# Altium schematic sheet STM8_LQFP64_DEVELOPMENT_BOARD.SchDoc
size A; SheetNumber: 1; SheetTotal: 1
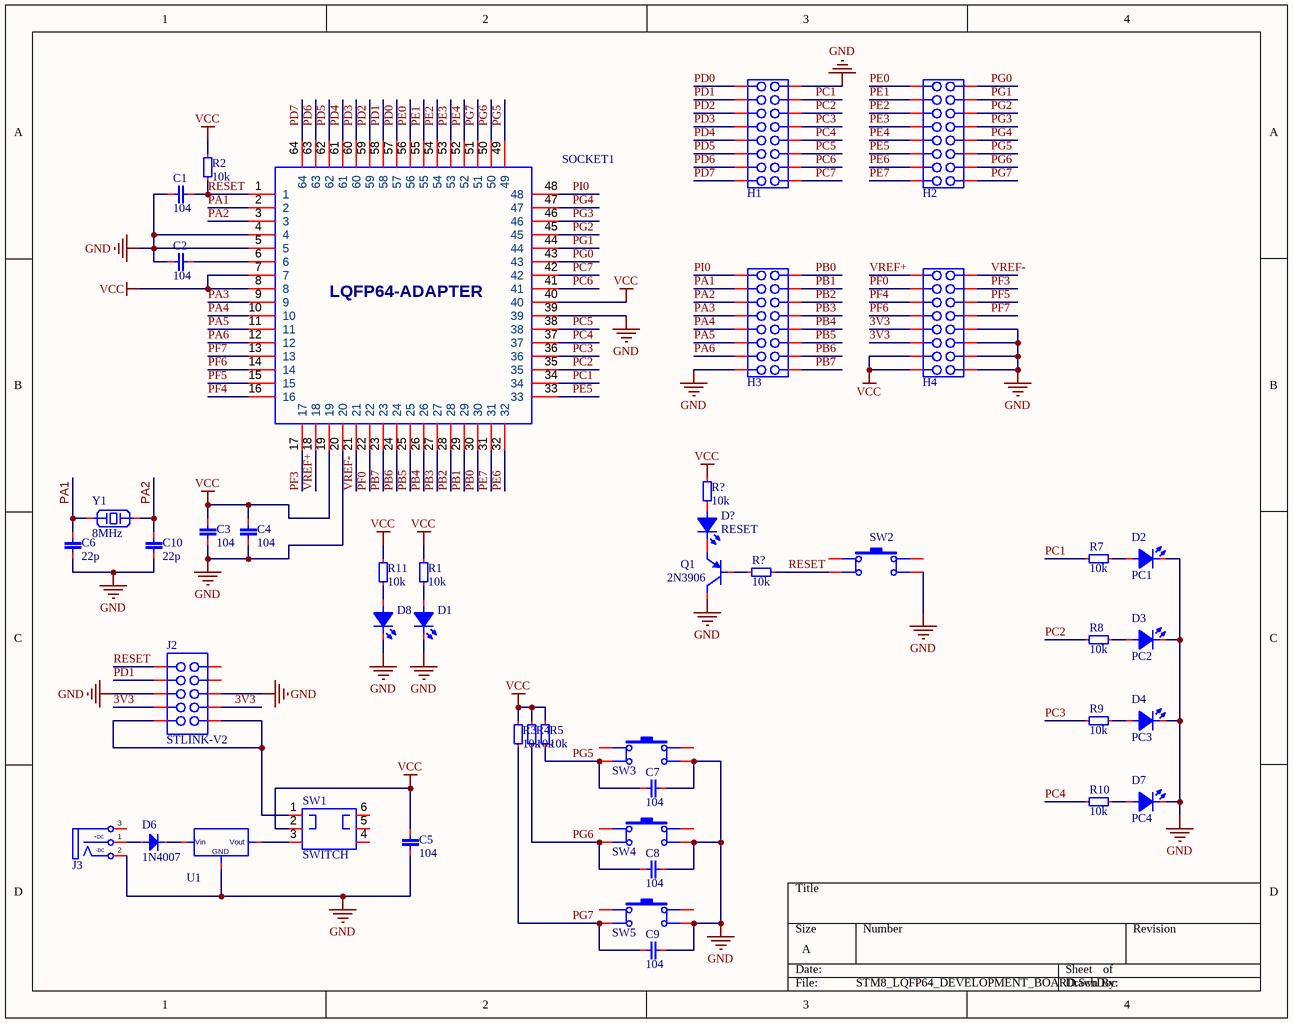
[diagram p0: STM8_LQFP64_DEVELOPMENT_BOARD.SchDoc]

## Parts
(Parts that share a designator on the sheet are numbered #1, #2 ... from top to bottom, then left to right.)
C1  104  [C0805]
C2  104  [C0805]
C3  104  [C1812]
C4  104  [C0805]
C5  104  [C1812]
C6  22p  [C0805]
C7  104  [C0805]
C8  104  [C0805]
C9  104  [C0805]
C10  22p  [C0805]
D1  LED0805  [L0805RED]  (value not drawn)
D2  PC1  [L0805RED]
D3  PC2  [L0805RED]
D4  PC3  [L0805RED]
D6  1N4007  [DO-214AC]
D7  PC4  [L0805RED]
D8  LED0805  [L0805RED]  (value not drawn)
D?  RESET  [L0805RED]
H1  HEADER-MALE-DOUBLE  [HEADER-MALE-DOUBLE-16PINS-2.54MM]  (value not drawn)
H2  HEADER-MALE-DOUBLE  [HEADER-MALE-DOUBLE-16PINS-2.54MM]  (value not drawn)
H3  HEADER-MALE-DOUBLE  [HEADER-MALE-DOUBLE-16PINS-2.54MM]  (value not drawn)
H4  HEADER-MALE-DOUBLE  [HEADER-MALE-DOUBLE-16PINS-2.54MM]  (value not drawn)
J2  STLINK-V2  [IDC_CONNECTOR_10x2.54]
J3  Connector  [DC_K375A_Power]  (value not drawn)
Q1  2N3906  [SOT23-3]
R1  10k  [R0805]
R2  10k  [R0805]
R3  10k  [R0805]
R4  10k  [R0805]
R5  10k  [R0805]
R7  10k  [R0805]
R8  10k  [R0805]
R9  10k  [R0805]
R10  10k  [R0805]
R11  10k  [R0805]
R?#1  10k  [R0805]
R?#2  10k  [R0805]
SOCKET1  STM8 MICROCONTROLLER  [SOCKET-ADAPTER-OTQ-64-05-03]  (value not drawn)
SW1  SWITCH  [SWITCH 5.8x5.8 6 PINS]
SW2  RESET  [BUTTON_HOLE_4.3mm]  (value not drawn)
SW3  PG5  [BUTTON_HOLE_4.3mm]  (value not drawn)
SW4  PG6  [BUTTON_HOLE_4.3mm]  (value not drawn)
SW5  PG7  [BUTTON_HOLE_4.3mm]  (value not drawn)
U1  AMS1117  [SOT223-3]  (value not drawn)
Y1  8MHz  [HC-49_THROUGH]

## Nets
GND: C1.1 C2.1 C3.1 C4.1 C5.1 C6.1 C7.2 C8.2 C9.2 C10.1 D1.2(K) D2.2(K) D3.2(K) D4.2(K) D7.2(K) D8.2(K) H1.2 H3.15 H4.10 H4.12 H4.14 H4.16 J2.5 J2.6 J3.2(DC-) Q1.3(C) SOCKET1.4 SOCKET1.5 SOCKET1.20 SOCKET1.39 SW2.4 SW3.4 SW4.4 SW5.4 U1.1
VCC: C3.2 C4.2 C5.2 H4.13 H4.15 R1.2 R2.1 R3.1 R4.1 R5.1 R11.2 R?#1.2 SOCKET1.7 SOCKET1.8 SOCKET1.19 SOCKET1.40 SW1.2
3V3: H4.9 H4.11 J2.7 J2.8
PA1: C6.2 H3.3 SOCKET1.2 Y1.1
PA2: C10.2 H3.5 SOCKET1.3 Y1.2
PA3: H3.7 SOCKET1.9
PA4: H3.9 SOCKET1.10
PA5: H3.11 SOCKET1.11
PA6: H3.13 SOCKET1.12
PB0: H3.2 SOCKET1.30
PB1: H3.4 SOCKET1.29
PB2: H3.6 SOCKET1.28
PB3: H3.8 SOCKET1.27
PB4: H3.10 SOCKET1.26
PB5: H3.12 SOCKET1.25
PB6: H3.14 SOCKET1.24
PB7: H3.16 SOCKET1.23
PC1: H1.4 R7.2 SOCKET1.34
PC2: H1.6 R8.2 SOCKET1.35
PC3: H1.8 R9.2 SOCKET1.36
PC4: H1.10 R10.2 SOCKET1.37
PC5: H1.12 SOCKET1.38
PC6: H1.14 SOCKET1.41
PC7: H1.16 SOCKET1.42
PD0: H1.1 SOCKET1.57
PD1: H1.3 J2.3 SOCKET1.58
PD2: H1.5 SOCKET1.59
PD3: H1.7 SOCKET1.60
PD4: H1.9 SOCKET1.61
PD5: H1.11 SOCKET1.62
PD6: H1.13 SOCKET1.63
PD7: H1.15 SOCKET1.64
PE0: H2.1 SOCKET1.56
PE1: H2.3 SOCKET1.55
PE2: H2.5 SOCKET1.54
PE3: H2.7 SOCKET1.53
PE4: H2.9 SOCKET1.52
PE5: H2.11 SOCKET1.33
PE6: H2.13 SOCKET1.32
PE7: H2.15 SOCKET1.31
PF0: H4.3 SOCKET1.22
PF3: H4.4 SOCKET1.17
PF4: H4.5 SOCKET1.16
PF5: H4.6 SOCKET1.15
PF6: H4.7 SOCKET1.14
PF7: H4.8 SOCKET1.13
PG0: H2.2 SOCKET1.43
PG1: H2.4 SOCKET1.44
PG2: H2.6 SOCKET1.45
PG3: H2.8 SOCKET1.46
PG4: H2.10 SOCKET1.47
PG5: C7.1 H2.12 R5.2 SOCKET1.49 SW3.2
PG6: C8.1 H2.14 R4.2 SOCKET1.50 SW4.2
PG7: C9.1 H2.16 R3.2 SOCKET1.51 SW5.2
PI0: H3.1 SOCKET1.48
RESET: C1.2 J2.1 R2.2 R?#2.1 SOCKET1.1 SW2.2
VREF+: H4.1 SOCKET1.18
VREF-: H4.2 SOCKET1.21
NetC2_2: C2.2 SOCKET1.6
NetD1_1: D1.1(A) R1.1
NetD2_1: D2.1(A) R7.1
NetD3_1: D3.1(A) R8.1
NetD4_1: D4.1(A) R9.1
NetD6_1: D6.1 J3.1(DS+)
NetD6_2: D6.2 U1.3
NetD7_1: D7.1(A) R10.1
NetD8_1: D8.1(A) R11.1
NetD?_1: D?.1(A) R?#1.1
NetD?_2: D?.2(K) Q1.2(E)
NetJ2_9: J2.9 J2.10 SW1.1
NetQ1_1: Q1.1(B) R?#2.2
NetSW1_3: SW1.3 U1.2

Not connected (* = marked no-connect by the designer): J2 2 4; J3 3(T); SW1 4 5 6; SW2 1 3; SW3 1 3; SW4 1 3; SW5 1 3

## Notes on the sheet
- (in symbol Ic-AMS1117(SOT-223)) Vin; Vout; GND
- (in symbol JackDC) +DC; -DC
- (in symbol Mcu-SOCKET-ADAPTER-OTQ-64-05-03) LQFP64-ADAPTER

## Library data of the parts
C1-C10 = Capacitors(SMD)
D2-D4 D7 D? = LED0805
D6 = Diode-1N4007
H1-H4 = HEADER-MALE-DOUBLE-16PINS-2.54MM
J2 = IDC_2.54_5x2
J3 = JackDC
Q1 = Transistor-2N3906 (SOT-23)
R1-R5 R7-R11 R?#1 R?#2 = Resistors-SMD
SOCKET1 = Mcu-SOCKET-ADAPTER-OTQ-64-05-03
SW1 = SWITCH-DPDT
SW2-SW5 = Button Hole
U1 = Ic-AMS1117(SOT-223)
Y1 = Crystal